# Altium schematic sheet IC - MCU.SchDoc
size A4; SheetNumber: 21; SheetTotal: 21
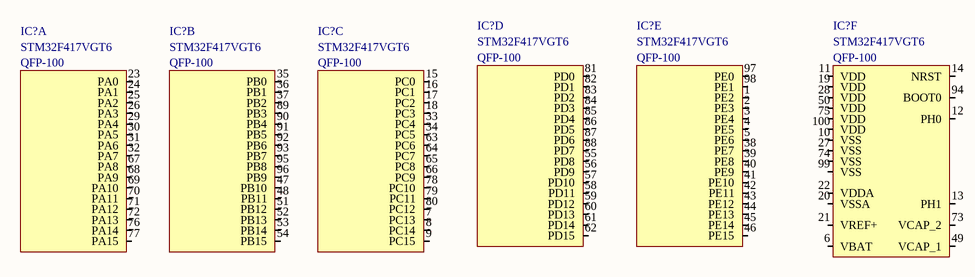
[diagram p0: IC - MCU.SchDoc]

## Parts
(Parts that share a designator on the sheet are numbered #1, #2 ... from top to bottom, then left to right.)
IC?#1  Manufacturer Part Number: STM32F417VGT6  Package: QFP-100  [QFP-100, 14mm x 14mm, 0.5mm]  (hidden comment: STM, STM32F417VxTx)  (part A of 6)
IC?#2  Manufacturer Part Number: STM32F417VGT6  Package: QFP-100  [QFP-100, 14mm x 14mm, 0.5mm]  (hidden comment: STM, STM32F417VxTx)  (part B of 6)
IC?#3  Manufacturer Part Number: STM32F417VGT6  Package: QFP-100  [QFP-100, 14mm x 14mm, 0.5mm]  (hidden comment: STM, STM32F417VxTx)  (part C of 6)
IC?#4  Manufacturer Part Number: STM32F417VGT6  Package: QFP-100  [QFP-100, 14mm x 14mm, 0.5mm]  (hidden comment: STM, STM32F417VxTx)  (part D of 6)
IC?#5  Manufacturer Part Number: STM32F417VGT6  Package: QFP-100  [QFP-100, 14mm x 14mm, 0.5mm]  (hidden comment: STM, STM32F417VxTx)  (part E of 6)
IC?#6  Manufacturer Part Number: STM32F417VGT6  Package: QFP-100  [QFP-100, 14mm x 14mm, 0.5mm]  (hidden comment: STM, STM32F417VxTx)  (part F of 6)

## Nets

Not connected (* = marked no-connect by the designer): IC?#1 23(PA0) 24(PA1) 25(PA2) 26(PA3) 29(PA4) 30(PA5) 31(PA6) 32(PA7) 67(PA8) 68(PA9) 69(PA10) 70(PA11) 71(PA12) 72(PA13) 76(PA14) 77(PA15); IC?#2 35(PB0) 36(PB1) 37(PB2) 47(PB10) 48(PB11) 51(PB12) 52(PB13) 53(PB14) 54(PB15) 89(PB3) 90(PB4) 91(PB5) 92(PB6) 93(PB7) 95(PB8) 96(PB9); IC?#3 7(PC13) 8(PC14) 9(PC15) 15(PC0) 16(PC1) 17(PC2) 18(PC3) 33(PC4) 34(PC5) 63(PC6) 64(PC7) 65(PC8) 66(PC9) 78(PC10) 79(PC11) 80(PC12); IC?#4 55(PD8) 56(PD9) 57(PD10) 58(PD11) 59(PD12) 60(PD13) 61(PD14) 62(PD15) 81(PD0) 82(PD1) 83(PD2) 84(PD3) 85(PD4) 86(PD5) 87(PD6) 88(PD7); IC?#5 1(PE2) 2(PE3) 3(PE4) 4(PE5) 5(PE6) 38(PE7) 39(PE8) 40(PE9) 41(PE10) 42(PE11) 43(PE12) 44(PE13) 45(PE14) 46(PE15) 97(PE0) 98(PE1); IC?#6 6(VBAT) 10(VSS) 11(VDD) 12(PH0) 13(PH1) 14(NRST) 19(VDD) 20(VSSA) 21(VREF+) 22(VDDA) 27(VSS) 28(VDD) 49(VCAP_1) 50(VDD) 73(VCAP_2) 74(VSS) 75(VDD) 94(BOOT0) 99(VSS) 100(VDD)

## Library data of the parts
IC?#1-IC?#6 = STM, STM32F417VxTx: IC, MCU, STM32F417, QFP-100; ComponentLink1Description: Datasheet; ComponentLink1URL: E:\Altium\Datasheets\IC - MCU\STM, STM32F415xx, STM32F417xx.pdf; ComponentLink2Description: Supplier Link; ComponentLink2URL: https://www.digikey.com/en/products/detail/stmicroelectronics/STM32F417VGT6/2757684; Supplier: Digikey; Supplier Part Number: 497-11900-ND; Manufacturer: STM; Operating Temperature, Min: -40℃; Operating Temperature, Max: +85℃; Quantity, Min: 1; Quantity, Max: 450; Price, Min: 19.05; Supplier Currency: $; Price, Max: 13.22667; Supplier Link: https://www.digikey.com/en/products/detail/stmicroelectronics/STM32F417VGT6/2757684; Component Type: MCU; Component Category: IC
  IC?#1: ComponentLink3Description: Programming Manual; ComponentLink3URL: E:\Altium\Datasheets\IC - MCU\STM, STM32 Cortex -M4 MCUs and MPUs programming manual.pdf